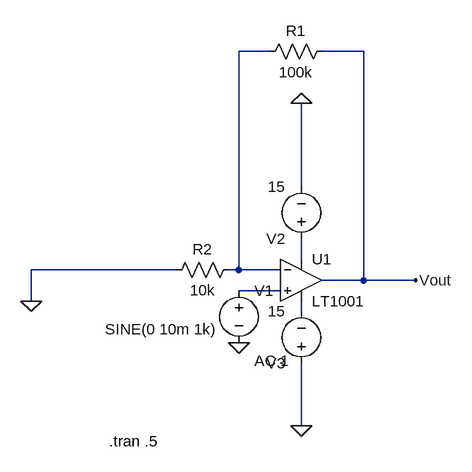
[diagram p0: schematic Q2 NON_INVERTING.asc]
Q2 NON_INVERTING.asc, the LTspice schematic file:
Version 4.1
SHEET 1 880 680
WIRE 208 -256 160 -256
WIRE 352 -256 288 -256
WIRE 256 -48 256 -176
WIRE 256 64 256 32
WIRE 64 80 -160 80
WIRE 160 80 160 -256
WIRE 160 80 144 80
WIRE 224 80 160 80
WIRE 352 96 352 -256
WIRE 352 96 288 96
WIRE 432 96 352 96
WIRE 224 112 160 112
WIRE -160 128 -160 80
WIRE 256 144 256 128
WIRE 256 320 256 224
FLAG -160 128 0
FLAG 160 192 0
FLAG 256 320 0
FLAG 256 -176 0
FLAG 432 96 Vout
SYMBOL OpAmps\\LT1001 256 32 R0
SYMATTR InstName U1
SYMBOL res 304 -272 R90
WINDOW 0 0 56 VBottom 2
WINDOW 3 32 56 VTop 2
SYMATTR InstName R1
SYMATTR Value 100k
SYMBOL res 160 64 R90
WINDOW 0 0 56 VBottom 2
WINDOW 3 32 56 VTop 2
SYMATTR InstName R2
SYMATTR Value 10k
SYMBOL voltage 256 48 R180
WINDOW 123 0 0 Left 0
WINDOW 39 0 0 Left 0
SYMATTR InstName V2
SYMATTR Value 15
SYMBOL voltage 256 240 R180
WINDOW 123 0 0 Left 0
WINDOW 39 0 0 Left 0
SYMATTR InstName V3
SYMATTR Value 15
SYMBOL voltage 160 96 R0
WINDOW 3 -206 75 Left 2
WINDOW 123 24 124 Left 2
WINDOW 39 0 0 Left 0
SYMATTR Value SINE(0 10m 1k)
SYMATTR Value2 AC 1
SYMATTR InstName V1
TEXT -40 344 Left 2 !.tran .5

The netlist it stands for:
* Q2 NON_INVERTING.asc
X§U1 N003 N001 N002 N004 Vout LT1001  ; pins In+ In- V+ V- OUT
R1 Vout N001 100k
R2 N001 0 10k
V2 N002 0 15
V3 0 N004 15
V1 N003 0 SINE(0 10m 1k) AC 1
.tran .5
.lib LTC.lib
.backanno
.end